# Altium project Fri3D_Air_2018_00.PrjPcb
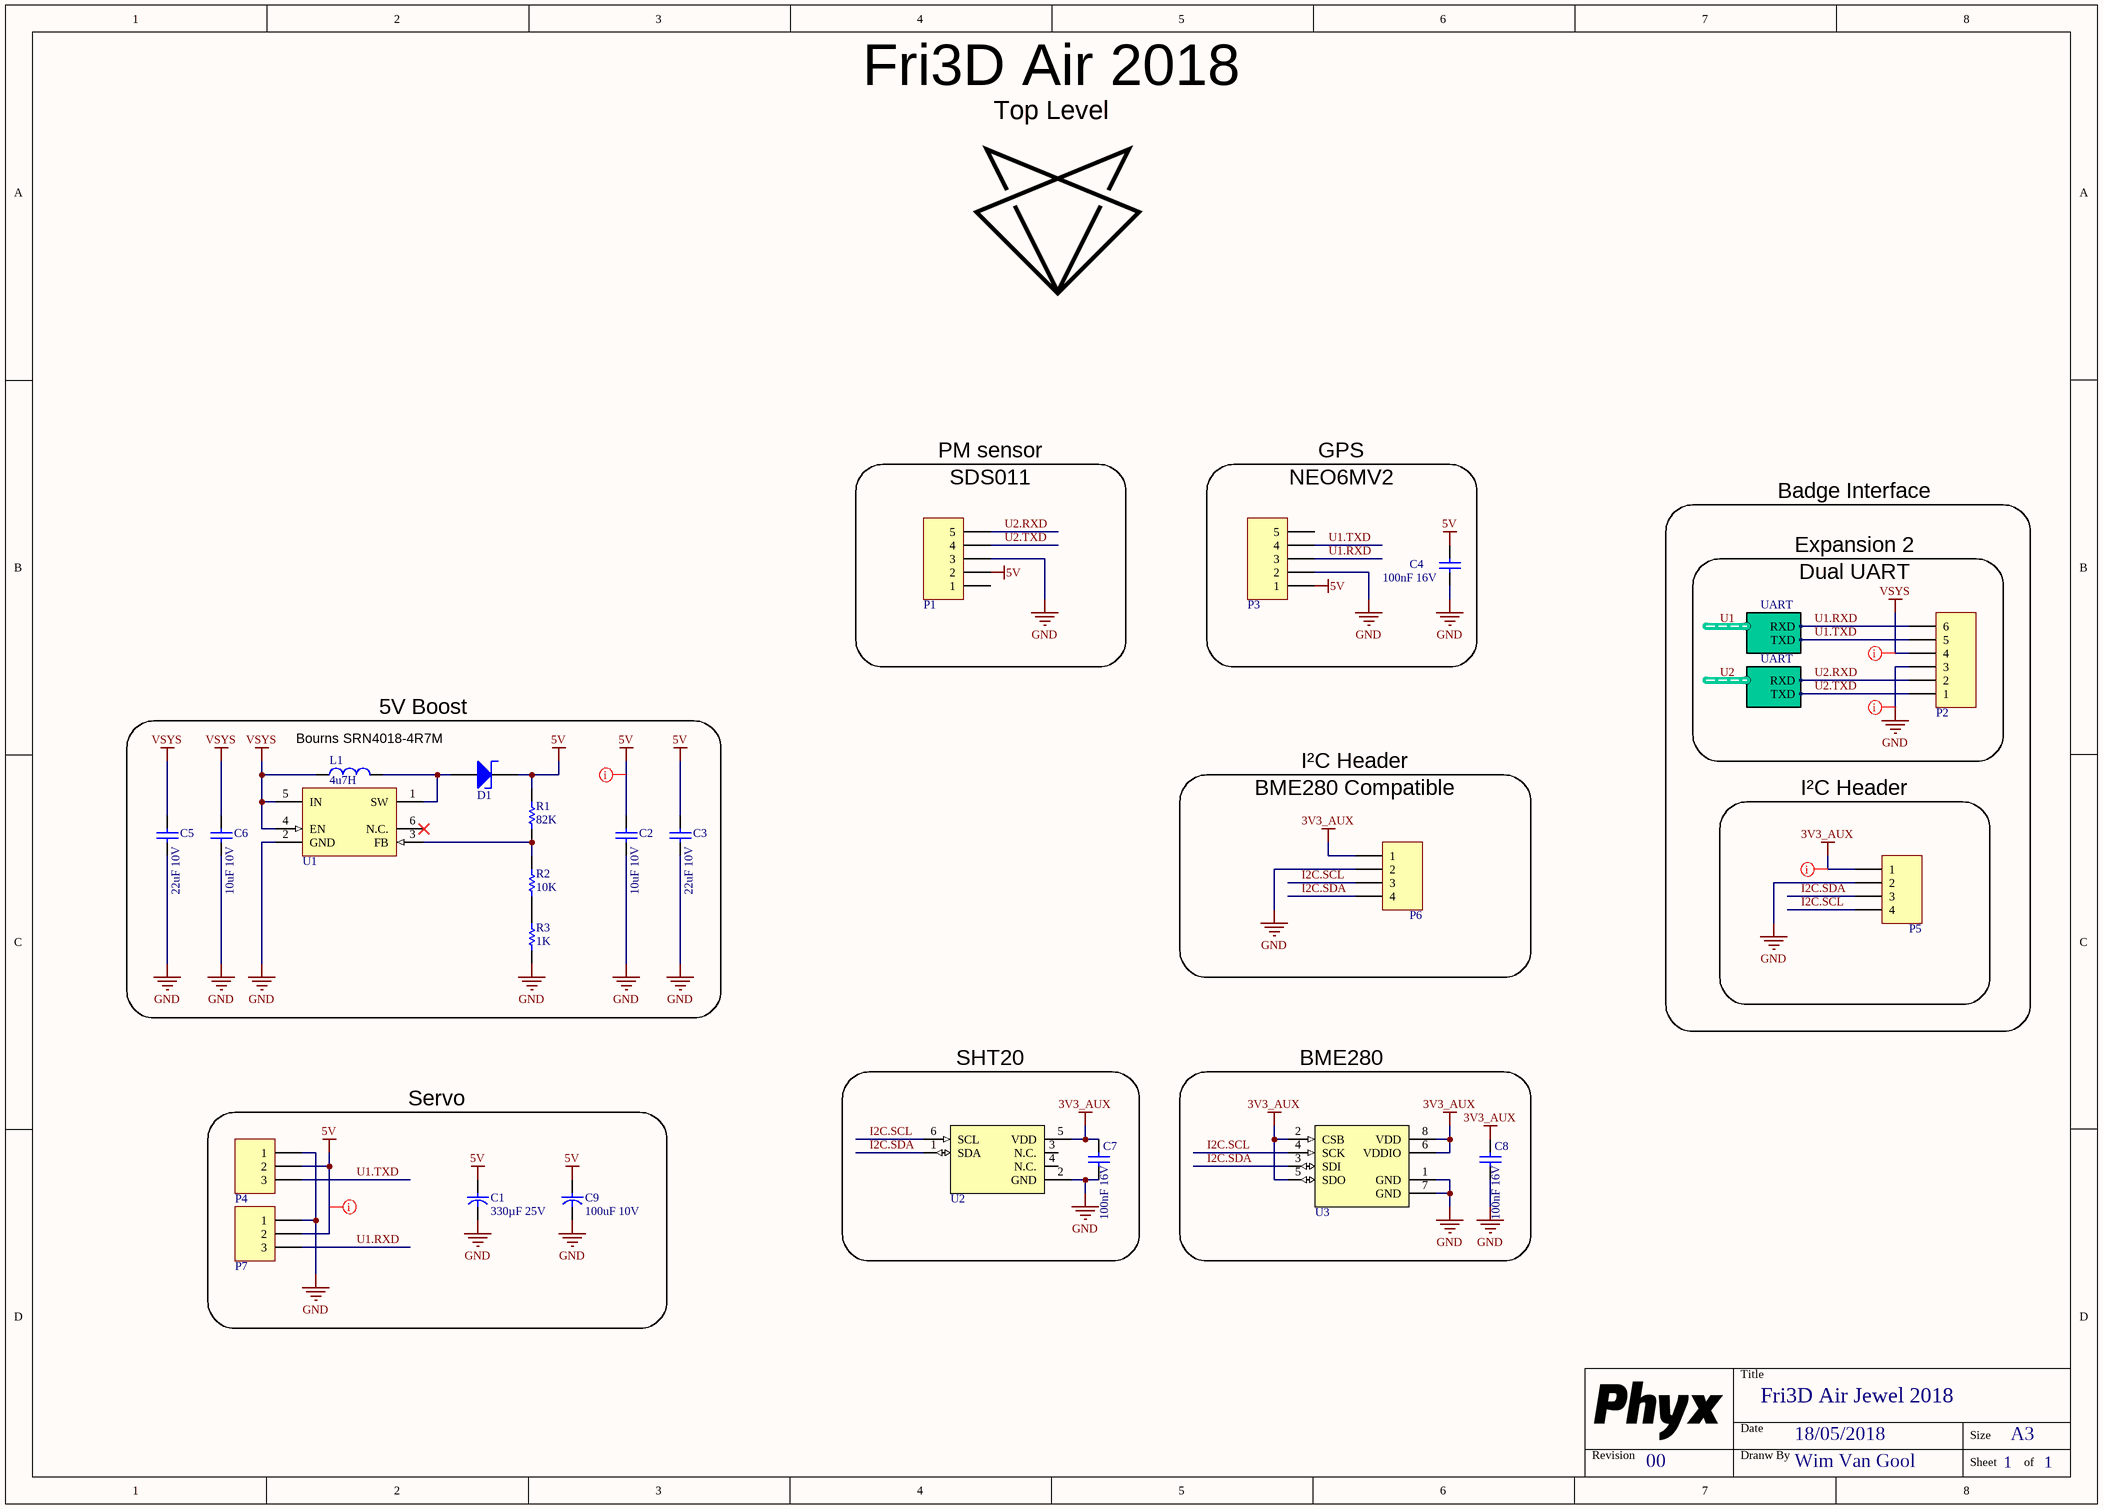
[diagram p0: Fri3D_Air_2018_00.SchDoc]
PCB_ENGINEER: WimVG; PCB_REV: 00; PCB_TITLE: Fri3D Air 2018
1 sheet, 24 parts. Net scope: global (net labels, ports and power ports of the same name join across sheets).
Board file: Fri3D_Air_2018_00.PcbDoc

## Sheet Fri3D_Air_2018_00.SchDoc: Fri3D Air Jewel 2018
size A3; Date: 18/05/2018; DrawnBy: Wim Van Gool; DocumentNumber: 1; Revision: 00; SheetNumber: 1; SheetTotal: 1

### Parts
C1  value 330µF 25V  [C_8x15_3.5mm]  (hidden comment: CAP_POL)
C2  value 10uF 10V  [C0805_N]  (hidden comment: CAP_CERAMIC)
C3  value 22uF 10V  [C1210_N]  (hidden comment: CAP_CERAMIC)
C4  value 100nF 16V  [C0603_N]
C5  value 22uF 10V  [C1210_N]  (hidden comment: CAP_CERAMIC)
C6  value 10uF 10V  [C0805_N]  (hidden comment: CAP_CERAMIC)
C7  value 100nF 16V  [C0603_N]
C8  value 100nF 16V  [C0603_N]
C9  value 100uF 10V  [C_5x11_2mm]  (hidden comment: CAP_POL)
D1  NTS260SFT1G  Schottky Rectifier, Single, 60 V, 2 A, SOD-123, 650 mV  [ON_SOD-123FL]  (value not drawn)
L1  value 4u7H  [SNL_SWPA4020]  (hidden comment: SWPA4020S4R7MT)
P1  Header 2.5mm RA Shrouded 5  [WE_68800511722]  (value not drawn)
P2  Header 6  [HDR1X6]  (value not drawn)
P3  Header 5  [HDR1X5]  (value not drawn)
P4  Header 3  [HDR1X3]  (value not drawn)
P5  Header 4  [HDR1X4]  (value not drawn)
P6  Header 4  [HDR1X4]  (value not drawn)
P7  Header 3  [HDR1X3]  (value not drawn)
R1  value 82K  [R0603_N]  (hidden comment: RESISTOR)
R2  value 10K  [R0603_N]  (hidden comment: RESISTOR)
R3  value 1K  [R0603_N]  (hidden comment: RESISTOR)
U1  High Efficiency 1.2MHz 2A Step Up Converter  SX1308  [SOT23-6]  (value not drawn)
U2  Sensirion SHT20 temperature and humidity sensor I2C  [SNS_DFN6]  (value not drawn)
U3  Bosch BME280 Temperature, humidity, pressure sensor I2C  [BOS_BME280]  (value not drawn)

### Blocks framed on the sheet
5V Boost: C2 C3 C5 C6 D1 L1 R1-R3 U1
I²C Header: P5
SHT20: C7 U2
BME280: C8 U3
Servo: C1 C9 P4 P7

### Harnesses
UART: TXD, RXD

### Nets
3V3_AUX: C7.1 C8.1 P5.1 P6.1 U2.5(VDD) U3.2(CSB) U3.5(SDO) U3.6(VDDIO) U3.8(VDD)
5V: C1.1 C2.1 C3.1 C4.1 C9.1 D1.1(C) P1.2 P3.1 P4.2 P7.2 R1.1
GND: C1.2 C2.2 C3.2 C4.2 C5.2 C6.2 C7.2 C8.2 C9.2 P1.3 P2.3 P3.2 P4.1 P5.2 P6.2 P7.1 R3.2 U1.2(GND) U2.2(GND) U3.1(GND) U3.7(GND)
VSYS: C5.1 C6.1 L1.1 P2.4 U1.4(EN) U1.5(IN)
I2C.SCL: P5.4 P6.3 U2.6(SCL) U3.4(SCK)
I2C.SDA: P5.3 P6.4 U2.1(SDA) U3.3(SDI)
U1.RXD: P2.6 P3.3 P7.3 ; harness UART.RXD
U1.TXD: P2.5 P3.4 P4.3 ; harness UART.TXD
U2.RXD: P1.5 P2.2 ; harness UART.RXD
U2.TXD: P1.4 P2.1 ; harness UART.TXD
NetD1_2: D1.2(A) L1.2 U1.1(SW)
NetR1_2: R1.2 R2.1 U1.3(FB)
NetR2_2: R2.2 R3.1

Not connected (* = marked no-connect by the designer): P1 1; P3 5; U1 6(N.C.)*; U2 3(N.C.) 4(N.C.)

### Layout directives
net class POWER: 3V3_AUX, 5V, GND, VSYS

### Notes on the sheet
- Fri3D Air 2018
- Top Level
- (near P1) SDS011
- PM sensor
- GPS
- (near P3) NEO6MV2
- Badge Interface
- Expansion 2
- (near P2) Dual UART
- (near L1) Bourns SRN4018-4R7M
- I²C Header
- BME280 Compatible
- Title
- Revision
- Date
- Dranw By
- Size
- A3
- Sheet
- of

### Library data of the parts
C1 = CAP 330µF 25V 8x15mm: Capacitor electrolyt; Supplier 1: Farnell; Supplier Part Number 1: 1855168
C2 C6 = CAP # 10uF 10V 0805: Capacitor Ceramic; Supplier 1: Farnell; Supplier Part Number 1: 2320859
C3 C5 = CAP # 22uF 10V 1210 X5R: Capacitor Ceramic
C4 C7 C8 = CAP # 100nF 16V 0603: Capacitor Ceramic
C9 = CAP 100uF 10V 5x11mm: Capacitor electrolyt; Supplier 1: Farnell; Supplier Part Number 1: 1902882
D1 = Schottky # NTS260SFT1G: =Description; Value: NTS260SFT1G; Supplier 1: Farnell; Supplier Part Number 1: 2473419
L1 = IND # 4u7H SWPA4020: Supplier 1: China; Supplier Part Number 1: SWPA4020S4R7MT
P1 = HDR # RA SHR 2.5mm 5way - 68800511722: Value: 68800511722; Supplier 1: Wurth; Supplier Part Number 1: 68800511722
P2 = Pin Header 2.54mm 6way
P3 = Pin Header 2.54mm 5way
P4 P7 = Pin Header 2.54mm 3way
P5 P6 = Pin Header 2.54mm 4way
R1 = RES # 82K 0603
R2 = RES # 10K 0603: Supplier 1: Farnell; Supplier Part Number 1: 2502397
R3 = RES # 1K 0603
U1 = PWR # Boost SX1308: =Description; Value: SX1308
U2 = TMP HUM # SHT20: =Description; Value: SHT20; Supplier 1: Digikey; Supplier Part Number 1: 1649-1004-1-ND
U3 = TMP HUM PRES # BME280: =Description; Value: BME280; Supplier 1: Mouser; Supplier Part Number 1: 262-BME280

## Assembly variants
Not Mounted: not fitted C1 C1 C3 C4 C5 C7 C8 C9 J1 P4 P7 U2 U3